# Altium schematic sheet A3_1.SchDoc: [Название]
size 420 x 297 mm; ApprovedBy: [Утвердил]; CheckedBy: [Пров.]; Author: [Разраб.]; CompanyName: [Компания]; DocumentNumber: [АБВГ.000000.000]; SheetNumber: [Лист]; SheetTotal: [Листов]; ProcessInspection: [Т. контр.]; NormInspection: [Н. контр.]; firstReference: [Перв. применение]; CopiedBy: [Копировал]; Litera: [Литера]; Title2: [Название 2]
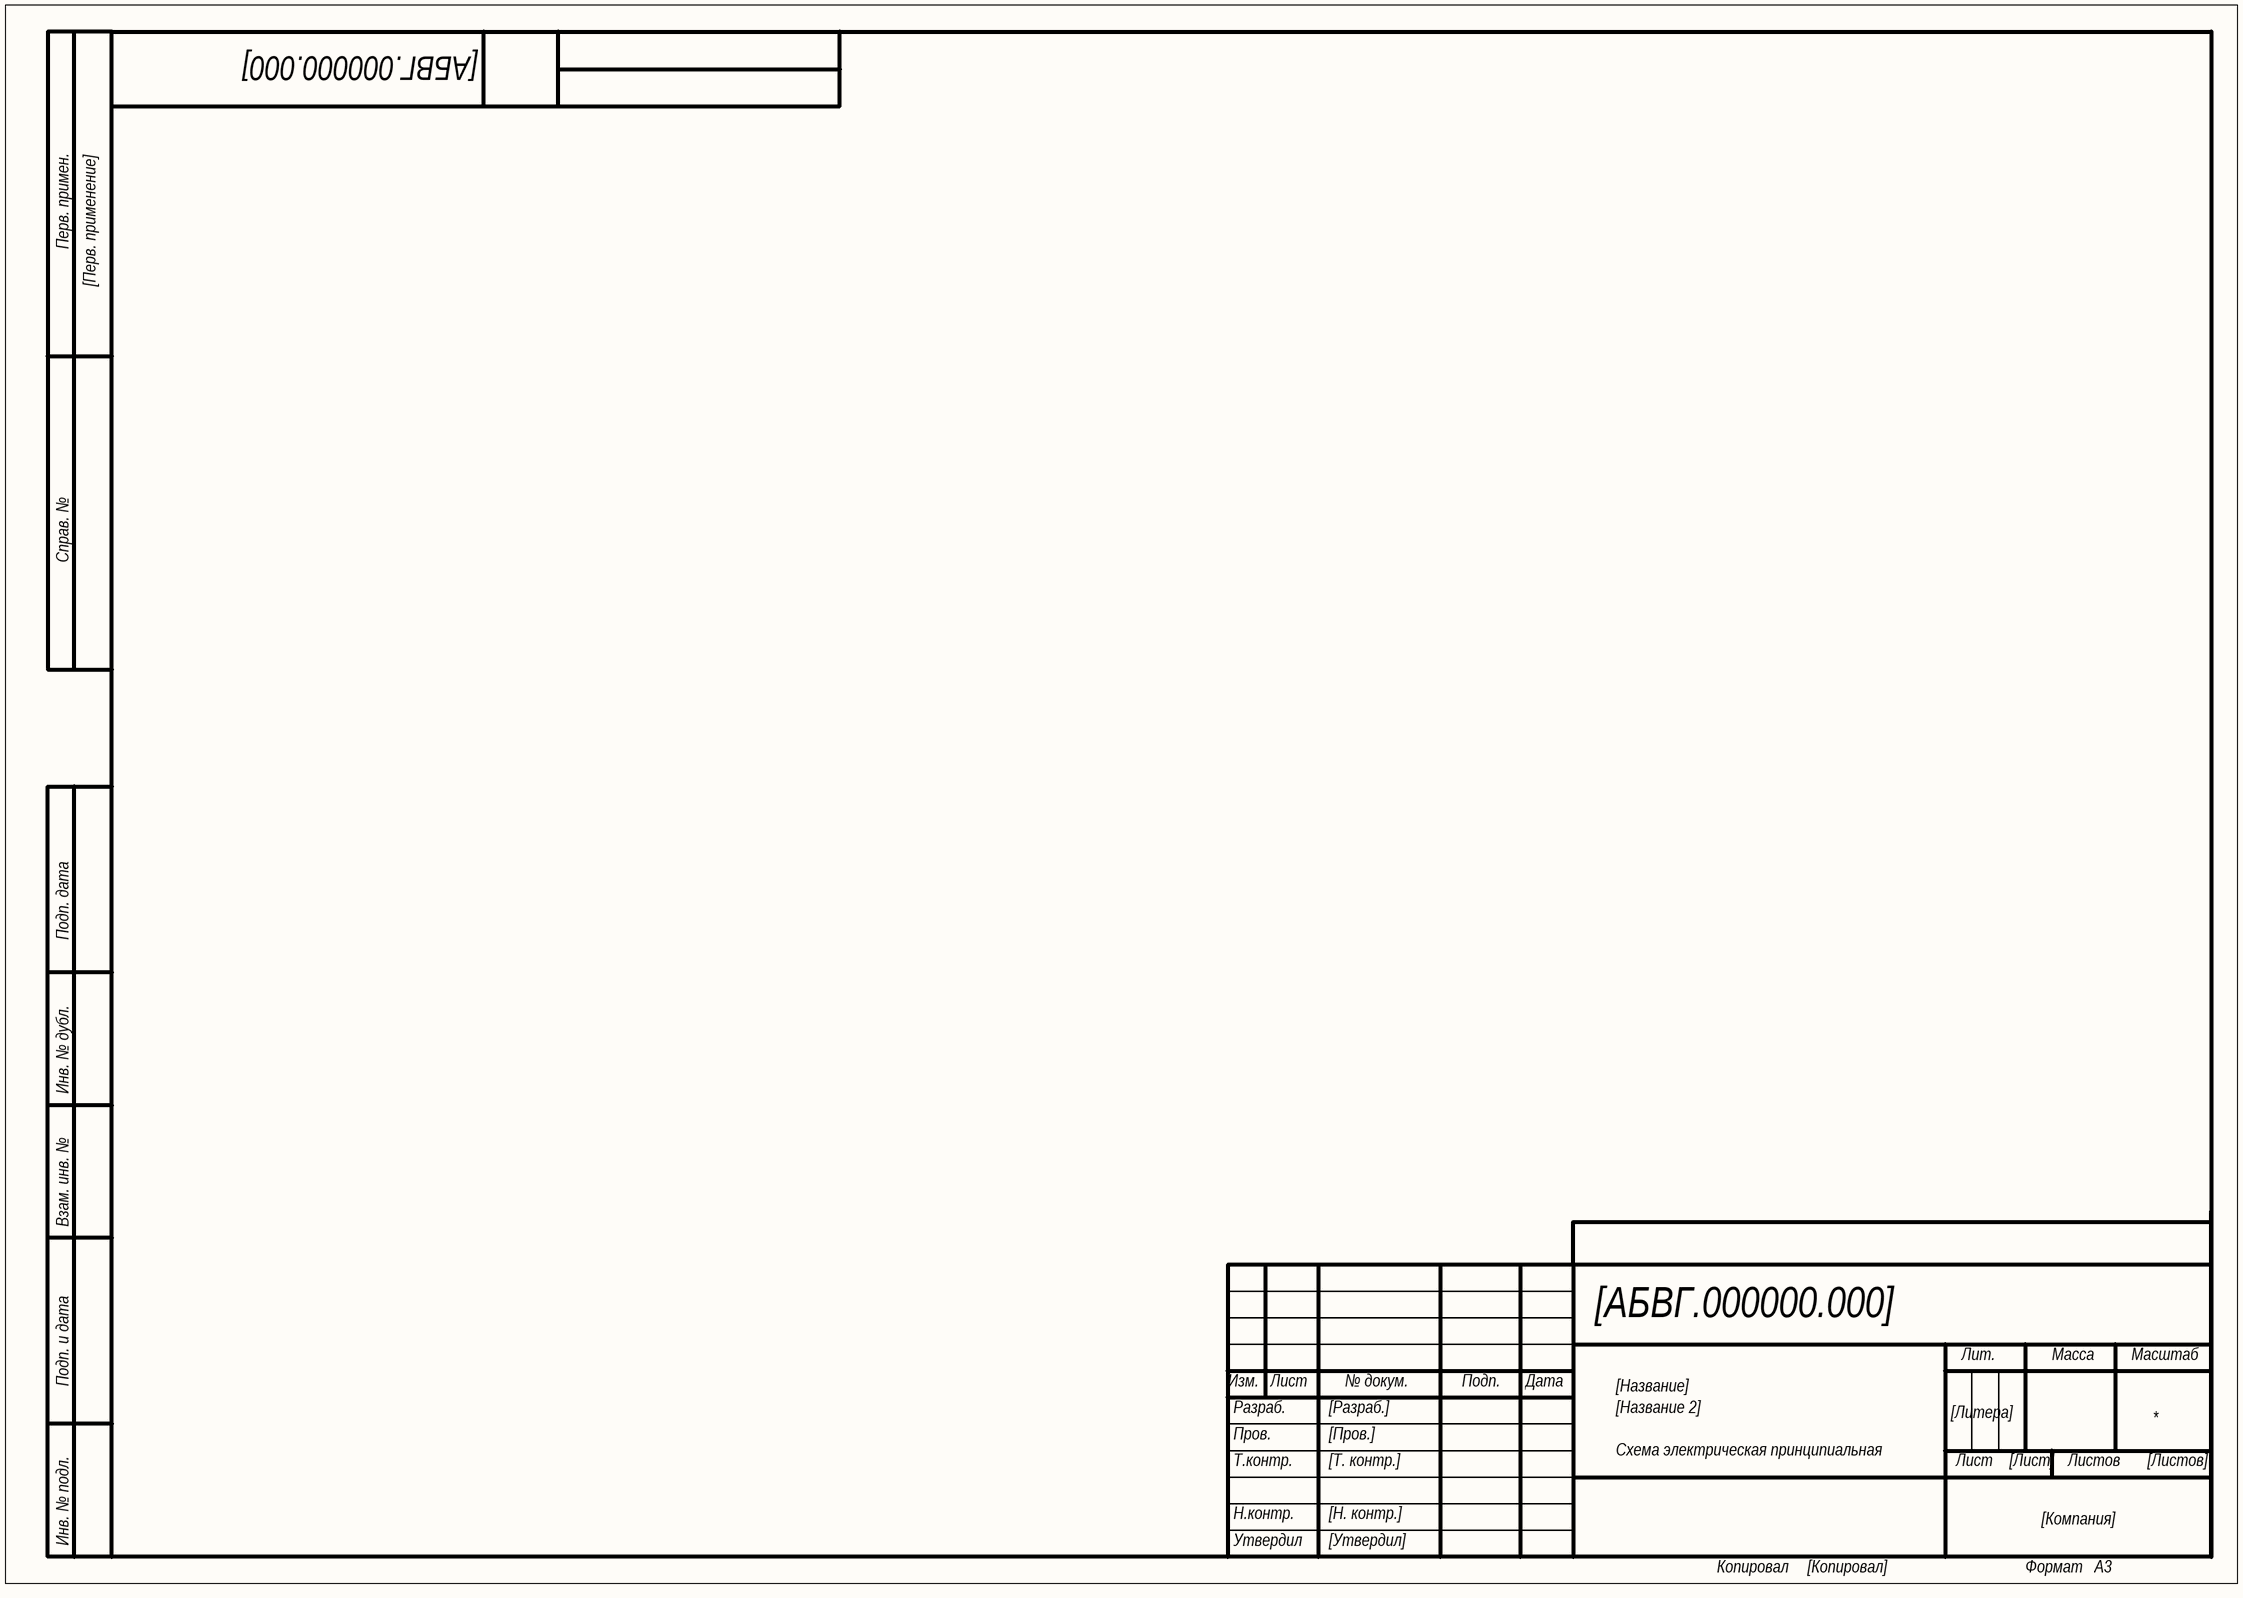
[diagram p0: A3_1.SchDoc]

## Notes on the sheet
- Перв. примен.
- Справ. №
- Подп. дата
- Инв. № дубл.
- Взам. инв. №
- Подп. и дата
- Изм.
- Лист
- № докум.
- Подп.
- Дата
- Лит.
- Масса
- Масштаб
- Разраб.
- Пров.
- Т.контр.
- Схема электрическая принципиальная
- Листов
- Инв. № подл.
- Н.контр.
- Утвердил
- Копировал
- Формат
- А3